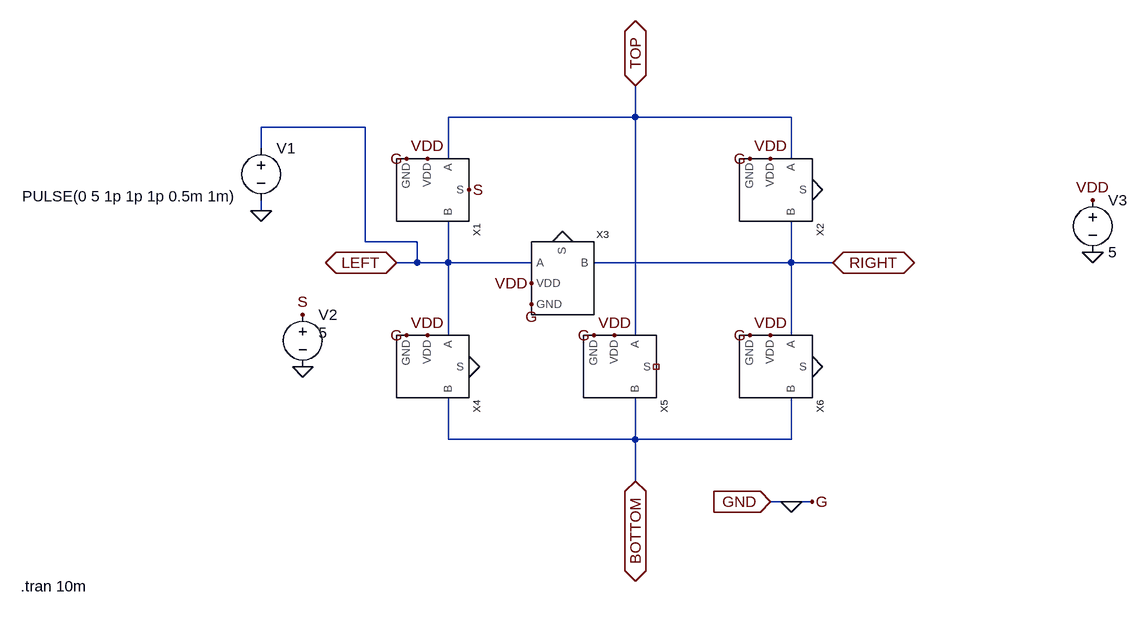
[diagram p0: schematic pmos switch test.asc]
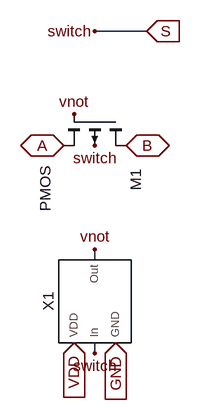
[diagram p1: sub-circuit gate_pmos.asc]
pmos switch test.asc, the LTspice schematic file:
Version 4
SHEET 1 1208 680
WIRE 448 -112 448 -160
WIRE 448 -112 160 -112
WIRE 688 -112 448 -112
WIRE 32 -96 -128 -96
WIRE -128 -64 -128 -96
WIRE 160 -48 160 -112
WIRE 688 -48 688 -112
WIRE -128 32 -128 16
WIRE 32 80 32 -96
WIRE 112 80 32 80
WIRE 112 112 112 80
WIRE 112 112 80 112
WIRE 160 112 160 48
WIRE 160 112 112 112
WIRE 288 112 160 112
WIRE 688 112 688 48
WIRE 688 112 384 112
WIRE 752 112 688 112
WIRE 160 224 160 112
WIRE 448 224 448 -112
WIRE 688 224 688 112
WIRE 160 384 160 320
WIRE 448 384 448 320
WIRE 448 384 160 384
WIRE 688 384 688 320
WIRE 688 384 448 384
WIRE 448 448 448 384
WIRE 688 480 656 480
WIRE 720 480 688 480
FLAG 448 -160 TOP
IOPIN 448 -160 BiDir
FLAG 448 448 BOTTOM
IOPIN 448 448 BiDir
FLAG 80 112 LEFT
IOPIN 80 112 BiDir
FLAG 752 112 RIGHT
IOPIN 752 112 BiDir
FLAG 656 480 GND
IOPIN 656 480 In
FLAG 720 480 G
FLAG -128 32 0
FLAG 688 480 0
FLAG -64 272 0
FLAG -64 192 S
FLAG 192 0 S
FLAG 1152 96 0
FLAG 1152 16 VDD
FLAG 128 -48 VDD
FLAG 288 144 VDD
FLAG 656 -48 VDD
FLAG 128 224 VDD
FLAG 416 224 VDD
FLAG 656 224 VDD
FLAG 624 224 G
FLAG 624 -48 G
FLAG 96 -48 G
FLAG 96 224 G
FLAG 384 224 G
FLAG 288 176 G
FLAG 336 80 0
FLAG 720 0 0
FLAG 720 272 0
FLAG 192 272 0
SYMBOL voltage -128 -80 R0
WINDOW 3 -368 90 Left 2
WINDOW 123 0 0 Left 0
WINDOW 39 0 0 Left 0
SYMATTR Value PULSE(0 5 1p 1p 1p 0.5m 1m)
SYMATTR InstName V1
SYMBOL voltage -64 176 R0
WINDOW 3 24 44 Left 2
WINDOW 123 0 0 Left 0
WINDOW 39 0 0 Left 0
SYMATTR Value 5
SYMATTR InstName V2
SYMBOL gate_pmos 144 0 R90
SYMATTR InstName X1
SYMBOL gate_pmos 672 0 R90
SYMATTR InstName X2
SYMBOL gate_pmos 336 128 R0
SYMATTR InstName X3
SYMBOL gate_pmos 144 272 R90
SYMATTR InstName X4
SYMBOL gate_pmos 432 272 R90
SYMATTR InstName X5
SYMBOL gate_pmos 672 272 R90
SYMATTR InstName X6
SYMBOL voltage 1152 0 R0
SYMATTR InstName V3
SYMATTR Value 5
TEXT -498 610 Left 2 !.tran 10m

gate_pmos.asc, the sub-circuit schematic file:
Version 4
SHEET 1 936 680
WIRE 464 -240 384 -240
WIRE 384 112 384 96
WIRE 384 256 384 240
FLAG 384 96 vnot
FLAG 384 -240 switch
FLAG 352 -112 vnot
FLAG 336 -64 A
IOPIN 336 -64 BiDir
FLAG 432 -64 B
IOPIN 432 -64 BiDir
FLAG 464 -240 S
IOPIN 464 -240 In
FLAG 384 -64 switch
FLAG 384 256 switch
FLAG 352 240 VDD
IOPIN 352 240 In
FLAG 416 240 GND
IOPIN 416 240 In
SYMBOL NOT 384 176 R270
SYMATTR InstName X1
SYMBOL pmos4 432 -112 R90
WINDOW 0 84 -15 Left 2
WINDOW 3 80 124 Left 2
SYMATTR InstName M1

The netlist it stands for:
* pmos switch test.asc
V1 LEFT 0 PULSE(0 5 1p 1p 1p 0.5m 1m)
V2 S 0 5
XX1 0 S VDD TOP LEFT gate_pmos
XX2 0 0 VDD TOP RIGHT gate_pmos
XX3 0 0 VDD LEFT RIGHT gate_pmos
XX4 0 0 VDD LEFT BOTTOM gate_pmos
XX5 0 NC_01 VDD TOP BOTTOM gate_pmos
XX6 0 0 VDD RIGHT BOTTOM gate_pmos
V3 VDD 0 5

* block symbol definitions
.subckt gate_pmos GND S VDD A B
XX1 GND S VDD vnot NOT  ; pins GND In VDD Out
M1 B vnot A S PMOS
.ends gate_pmos

.model NMOS NMOS
.model PMOS PMOS
.lib standard.mos
.tran 10m
.backanno
.end